# Altium schematic sheet Wifi.SchDoc: =ProjectTitle
size B; Engineer: H. Collector; Organization: IMR Engineering; Address1: 3621 Gin Way; Address2: Snellville, GA 30039; Address3: USA; SheetNumber: 9; SheetTotal: 10
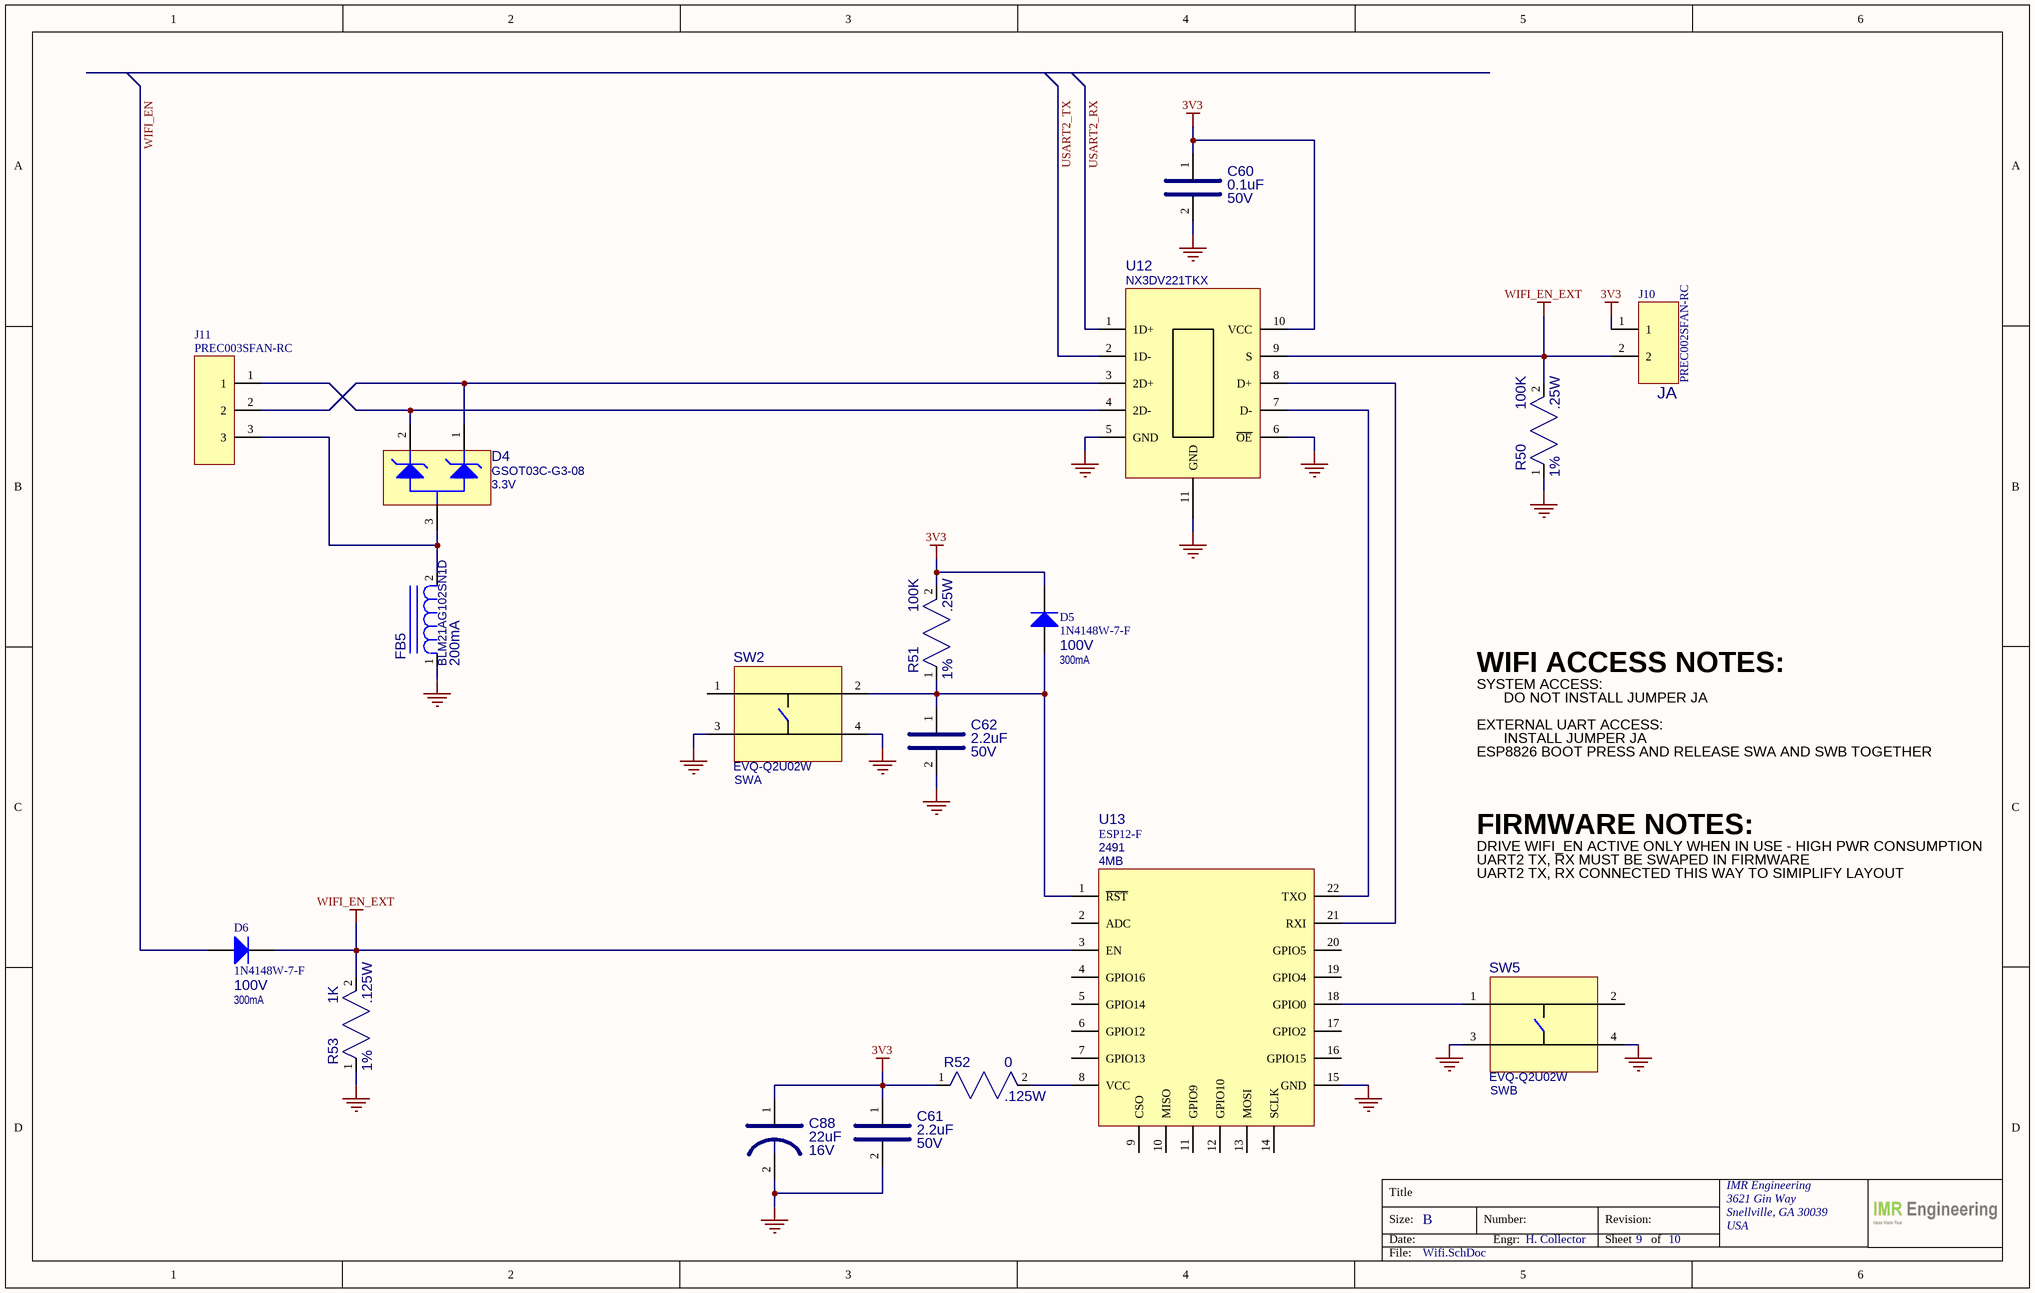
[diagram p0: Wifi.SchDoc]

## Parts
C60  value 0.1uF  VOLTAGE: 50V  [CAP_0805]  (hidden comment: 08055C104KAT2A)
C61  value 2.2uF  VOLTAGE: 50V  [CAP_0805]  (hidden comment: UMK212BB7225MG-T)
C62  value 2.2uF  VOLTAGE: 50V  [CAP_0805]  (hidden comment: UMK212BB7225MG-T)
C88  value 22uF  VOLTAGE: 16V  [CAP_2312]  (hidden comment: TRJC226K016RRJ)
D4  value 3.3V  [SOT-23]  (hidden comment: GSOT03C-G3-08)
D5  value 100V  CURRENT: 300mA  [SOD123]  (hidden comment: 1N4148W-7-F)
D6  value 100V  CURRENT: 300mA  [SOD123]  (hidden comment: 1N4148W-7-F)
FB5  value 200mA  [RES_0805]  (hidden comment: BLM21AG102SN1D)
J10  PREC002SFAN-RC  OPERATION_NOTE: JA  [HDR_1X2_100MILL]
J11  PREC003SFAN-RC  [HDR_1X3_100MILL]
R50  value 100K  TOLERANCE: 1%  POWER: .25W  [PMG_RES_0805]  (hidden comment: RK73H2ATTD1003F)
R51  value 100K  TOLERANCE: 1%  POWER: .25W  [PMG_RES_0805]  (hidden comment: RK73H2ATTD1003F)
R52  value 0  POWER: .125W  [PMG_RES_0805]  (hidden comment: RC0805JR-070RL)
R53  value 1K  TOLERANCE: 1%  POWER: .125W  [RES_0805]  (hidden comment: RC0805FR-071KL)
SW2  OPERATION_NOTE: SWA  [SW_EVQ-Q2U02W]  (hidden comment: EVQ-Q2U02W)
SW5  OPERATION_NOTE: SWB  [SW_EVQ-Q2U02W]  (hidden comment: EVQ-Q2U02W)
U12  NX3DV221TKX  [PMG_NX3DV221TKX]
U13  PACKAGE: ESP12-F  FLASH: 4MB  [XCVR_ESP8266-12E/ESP-12E]  (hidden comment: 2491)

## Nets
3V3: C60.1 C61.1 C88.1 D5.2(K) J10.1 R51.2 R52.1 U12.10(VCC)
GND: C60.2 C61.2 C62.2 C88.2 FB5.1 R50.1 R53.1 SW2.3(A) SW2.4(A') SW5.3(A) SW5.4(A') U12.5(GND) U12.6(~{OE}) U12.11(GND) U13.15(GND)
WIFI_EN_EXT: D6.2(K) J10.2 R50.2 R53.2 U12.9(S) U13.3(EN)
USART2_RX: U12.1(1D+)
USART2_TX: U12.2(1D-)
WIFI_EN: D6.1(A)
NetC62_1: C62.1 D5.1(A) R51.1 SW2.2(B') U13.1(~{RST})
NetD4_1: D4.1(A1) J11.2 U12.3(2D+)
NetD4_2: D4.2(A2) J11.1 U12.4(2D-)
NetD4_3: D4.3(A) FB5.2 J11.3
NetR52_2: R52.2 U13.8(VCC)
NetSW5_1: SW5.1(B) U13.18(GPIO0)
NetU12_7: U12.7(D-) U13.22(TXO)
NetU12_8: U12.8(D+) U13.21(RXI)

Not connected (* = marked no-connect by the designer): SW2 1(B); SW5 2(B'); U13 2(ADC) 4(GPIO16) 5(GPIO14) 6(GPIO12) 7(GPIO13) 9(CSO) 10(MISO) 11(GPIO9) 12(GPIO10) 13(MOSI) 14(SCLK) 16(GPIO15) 17(GPIO2) 19(GPIO4) 20(GPIO5)

## Notes on the sheet
- WIFI ACCESS NOTES:
- SYSTEM ACCESS:
- DO NOT INSTALL JUMPER JA
- EXTERNAL UART ACCESS:
- ESP8826 BOOT PRESS AND RELEASE SWA AND SWB TOGETHER
- INSTALL JUMPER JA
- FIRMWARE NOTES:
- DRIVE WIFI_EN ACTIVE ONLY WHEN IN USE - HIGH PWR CONSUMPTION
- UART2 TX, RX MUST BE SWAPED IN FIRMWARE
- UART2 TX, RX CONNECTED THIS WAY TO SIMIPLIFY LAYOUT
- Title
- Size:
- Date:
- B
- Number:
- Engr:
- Revision:
- Sheet
- of
- File:

## Library data of the parts
C60 = CAP_0.1UF_50V_0805: CAP CER 0.1UF 50V X7R 0805; MFG: AVX; TOLERANCE: 10%; MFG_PN: 08055C104KAT2A; Supplier 1: Digi-Key; Supplier Part Number 1: 478-1395-1-ND; Case/Package: 0805
C61 C62 = CAP_2.2UF_50V_0805: CAP CER 2.2UF 50V X7R 0805; MFG: Taiyo Yuden; TOLERANCE: 20%; MFG_PN: UMK212BB7225MG-T; Supplier 1: Digi-Key; Supplier Part Number 1: 587-4963-1-ND; Case/Package: 0805
C88 = CAP_22UF_16V_TANT: CAP TANT 22UF 10% 16V 2312; MFG: AVX Corporation; MFG_PN: TRJC226K016RRJ; TOLERANCE: 10%; Supplier 1: Digi-Key; Supplier Part Number 1: 478-11127-1-ND
D4 = DIODE_TVS_GSOT03C-G3-08: TVS DIODE 3.3V 12.3V SOT23; MFG: Vishay Semiconductor; POWER: 30A (8/20us); Case/Package: SOT-23; Supplier 1: Digi-Key; Supplier Part Number 1: GSOT03C-G3-08GICT-ND; MFG_PN: GSOT03C-G3-08
D5 D6 = DIODE_1N4148W-7-F: DIODE GEN PURP 100V 300MA SOD123; MFG: Diodes Incorporated; Case/Package: SOD-123; Supplier 1: Digi-Key; Supplier Part Number 1: 1N4148W-FDICT-ND; MFG_PN: 1N4148W-7-F
FB5 = FERRITE_BLM21AG102SN1D: FERRITE, 1KOHM AT 100MHZ, 220MA, .450DCR; MFG: MURATA; TOLERANCE: 10%; Supplier 1: Digi-Key; Supplier Part Number 1: 490-1041-1-ND; MFG_PN: BLM21AG102SN1D
J10 = CONN_2P_SINGLE_ROW: CONN HEADER VERT 2POS 2.54MM; MFG: Sullins Connector Solutions; Case/Package: 2P_2.54MM; MFG_PN: PREC002SFAN-RC; Supplier 1: Digi-Key; Supplier Part Number 1: S1212EC-02-ND; Value: *
J11 = CONN_3P_SINGLE_ROW: CONN HEADER VERT 3POS 2.54MM; MFG: Sullins Connector Solutions; Case/Package: 3P_2.54MM; MFG_PN: PREC003SFAN-RC; Supplier 1: Digi-Key; Supplier Part Number 1: S1212EC-03-ND; Value: *
R50 R51 = RES_100K_0805_1/4W_1%: RES SMD 100K OHM 1% 1/4W 0805; MFG: KOA Speer Electronics, Inc.; Case/Package: 0805; MFG_PN: RK73H2ATTD1003F; Supplier 1: Digi-Key; Supplier Part Number 1: 2019-RK73H2ATTD1003FCT-ND
R52 = RES_0_0805_1/8W: RES SMD 0 OHM JUMPER 1/8W 0805; MFG: Yageo; Case/Package: 0805; MFG_PN: RC0805JR-070RL; Supplier 1: Digi-Key; Supplier Part Number 1: 311-0.0ARCT-ND; TOLERANCE: JUMPER
R53 = RES_1K_0805_1/8W_1%: RES SMD 1K OHM 1% 1/8W 0805; MFG: Yageo; Case/Package: 0805; MFG_PN: RC0805FR-071KL; Supplier 1: Digi-Key; Supplier Part Number 1: 311-1.00KCRCT-ND
SW2 SW5 = SWITCH_EVQ-Q2U02W: SWITCH TACTILE SPST-NO 0.02A 15V; MFG: Panasonic Electronic Components; Case/Package: EVQ-Q2; Supplier 1: Digi-Key; Supplier Part Number 1: P12954SCT-ND; VALUE: 15V; MFG_PN: EVQ-Q2U02W
U12 = IC_NX3DV221TKX: IC USB 2.0 SWITCH HS 10HVSON; MFG: NXP USA Inc.; Case/Package: 10-DFN; Supplier 1: Digi-Key; Supplier Part Number 1: 568-10368-1-ND; MFG_PN: NX3DV221TKX
U13 = MODULE_2491: RX TXRX MOD WIFI TRACE ANT SMD 4MB; MFG: Adafruit Industries LLC; Supplier 1: Digi-Key; Supplier Part Number 1: 1528-1438-ND; Case/Package: ESP-12F; MFG_PN: 2491